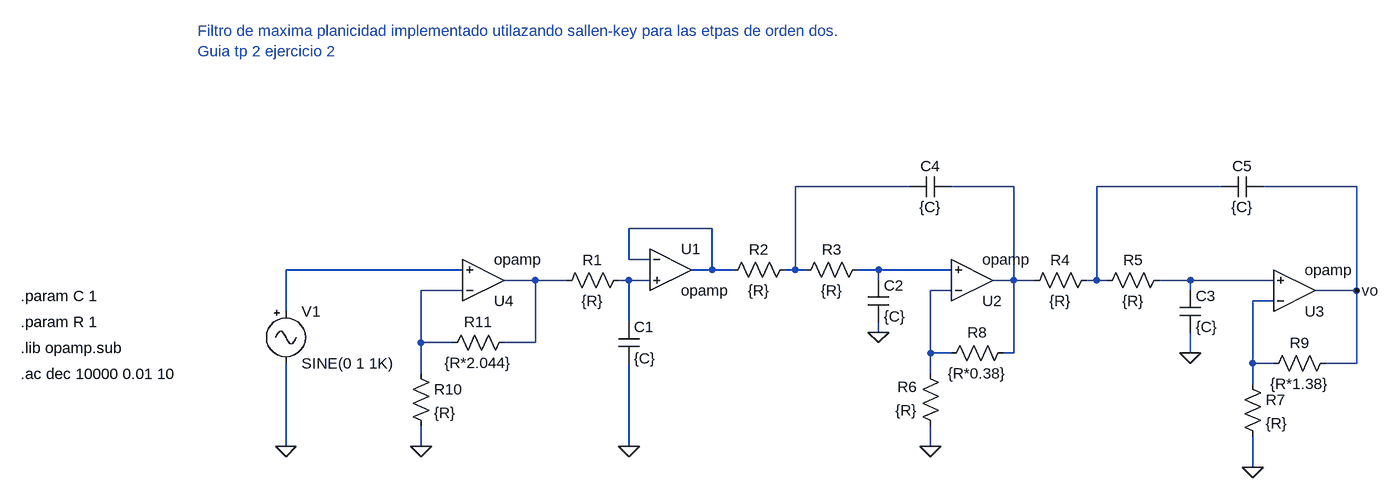
[diagram p0: schematic Draft1.asc]
Draft1.asc, the LTspice schematic file:
Version 4
SHEET 1 1212 680
WIRE 496 160 320 160
WIRE 656 160 560 160
WIRE 976 160 784 160
WIRE 1184 160 1040 160
WIRE 192 224 64 224
WIRE 64 272 64 224
WIRE 96 272 64 272
WIRE -192 288 -464 288
WIRE 192 288 192 224
WIRE 192 288 160 288
WIRE 224 288 192 288
WIRE 320 288 320 160
WIRE 320 288 304 288
WIRE 336 288 320 288
WIRE 448 288 416 288
WIRE 560 288 448 288
WIRE -80 304 -128 304
WIRE -32 304 -80 304
WIRE 64 304 48 304
WIRE 96 304 64 304
WIRE 448 304 448 288
WIRE 656 304 656 160
WIRE 656 304 624 304
WIRE 688 304 656 304
WIRE 784 304 784 160
WIRE 784 304 768 304
WIRE 800 304 784 304
WIRE 928 304 880 304
WIRE 1056 304 928 304
WIRE -192 320 -256 320
WIRE 560 320 528 320
WIRE 928 320 928 304
WIRE 1184 320 1184 160
WIRE 1184 320 1120 320
WIRE 1056 336 1024 336
WIRE -464 352 -464 288
WIRE 64 368 64 304
WIRE 448 384 448 368
WIRE -256 400 -256 320
WIRE -208 400 -256 400
WIRE -80 400 -80 304
WIRE -80 400 -128 400
WIRE 528 416 528 320
WIRE 560 416 528 416
WIRE 656 416 656 304
WIRE 656 416 640 416
WIRE 928 416 928 384
WIRE 1024 432 1024 336
WIRE 1056 432 1024 432
WIRE 1184 432 1184 320
WIRE 1184 432 1136 432
WIRE -256 448 -256 400
WIRE 528 448 528 416
WIRE 1024 464 1024 432
WIRE -464 560 -464 432
WIRE -256 560 -256 528
WIRE 64 560 64 432
WIRE 528 560 528 528
WIRE 1024 592 1024 544
FLAG 528 560 0
FLAG 64 560 0
FLAG -464 560 0
FLAG 1024 592 0
FLAG 448 384 0
FLAG 928 416 0
FLAG 1184 320 vo
FLAG -256 560 0
SYMBOL res 64 288 R90
WINDOW 0 0 56 VBottom 2
WINDOW 3 32 56 VTop 2
SYMATTR InstName R1
SYMATTR Value {R}
SYMBOL res 320 272 R90
WINDOW 0 0 56 VBottom 2
WINDOW 3 32 56 VTop 2
SYMATTR InstName R2
SYMATTR Value {R}
SYMBOL res 432 272 R90
WINDOW 0 0 56 VBottom 2
WINDOW 3 32 56 VTop 2
SYMATTR InstName R3
SYMATTR Value {R}
SYMBOL res 784 288 R90
WINDOW 0 0 56 VBottom 2
WINDOW 3 32 56 VTop 2
SYMATTR InstName R4
SYMATTR Value {R}
SYMBOL res 896 288 R90
WINDOW 0 0 56 VBottom 2
WINDOW 3 32 56 VTop 2
SYMATTR InstName R5
SYMATTR Value {R}
SYMBOL res 544 544 R180
WINDOW 0 36 76 Left 2
WINDOW 3 36 40 Left 2
SYMATTR InstName R6
SYMATTR Value {R}
SYMBOL res 1008 448 R0
SYMATTR InstName R7
SYMATTR Value {R}
SYMBOL res 656 400 R90
WINDOW 0 0 56 VBottom 2
WINDOW 3 32 56 VTop 2
SYMATTR InstName R8
SYMATTR Value {R*0.38}
SYMBOL res 1152 416 R90
WINDOW 0 0 56 VBottom 2
WINDOW 3 32 56 VTop 2
SYMATTR InstName R9
SYMATTR Value {R*1.38}
SYMBOL cap 48 368 R0
SYMATTR InstName C1
SYMATTR Value {C}
SYMBOL cap 432 304 R0
SYMATTR InstName C2
SYMATTR Value {C}
SYMBOL cap 912 320 R0
SYMATTR InstName C3
SYMATTR Value {C}
SYMBOL cap 560 144 R90
WINDOW 0 0 32 VBottom 2
WINDOW 3 32 32 VTop 2
SYMATTR InstName C4
SYMATTR Value {C}
SYMBOL cap 1040 144 R90
WINDOW 0 0 32 VBottom 2
WINDOW 3 32 32 VTop 2
SYMATTR InstName C5
SYMATTR Value {C}
SYMBOL Opamps/opamp 128 224 R0
SYMATTR InstName U1
SYMBOL Opamps/opamp 592 368 M180
SYMATTR InstName U2
SYMBOL Opamps/opamp 1088 384 M180
SYMATTR InstName U3
SYMBOL Misc/signal -464 336 R0
SYMATTR InstName V1
SYMATTR Value2 AC 1
SYMBOL Opamps/opamp -160 368 M180
SYMATTR InstName U4
SYMBOL res -272 432 R0
SYMATTR InstName R10
SYMATTR Value {R}
SYMBOL res -112 384 R90
WINDOW 0 0 56 VBottom 2
WINDOW 3 32 56 VTop 2
SYMATTR InstName R11
SYMATTR Value {R*2.044}
TEXT -872 368 Left 2 !.param R 1
TEXT -872 328 Left 2 !.param C 1
TEXT -872 408 Left 2 !.lib opamp.sub
TEXT -872 448 Left 2 !.ac dec 10000 0.01 10
TEXT -600 -80 Left 2 ;Filtro de maxima planicidad implementado utilazando sallen-key para las etpas de orden dos.\nGuia tp 2 ejercicio 2

The netlist it stands for:
* Draft1.asc
R1 N008 N007 {R}
R2 N001 N004 {R}
R3 N006 N001 {R}
R4 N003 N002 {R}
R5 N009 N003 {R}
R6 0 N011 {R}
R7 N012 0 {R}
R8 N002 N011 {R*0.38}
R9 vo N012 {R*1.38}
C1 N008 0 {C}
C2 N006 0 {C}
C3 N009 0 {C}
C4 N002 N001 {C}
C5 vo N003 {C}
XU1 N004 N008 N004 opamp Aol=100K GBW=10Meg  ; pins invin noninvin out
XU2 N011 N006 N002 opamp Aol=100K GBW=10Meg  ; pins invin noninvin out
XU3 N012 N009 vo opamp Aol=100K GBW=10Meg  ; pins invin noninvin out
V1 N005 0 SINE(0 1 1K) AC 1
XU4 N010 N005 N007 opamp Aol=100K GBW=10Meg  ; pins invin noninvin out
R10 N010 0 {R}
R11 N007 N010 {R*2.044}
.param R 1
.param C 1
.lib opamp.sub
.ac dec 10000 0.01 10
* Filtro de maxima planicidad implementado utilazando sallen-key para las etpas de orden dos.
* Guia tp 2 ejercicio 2
.backanno
.end